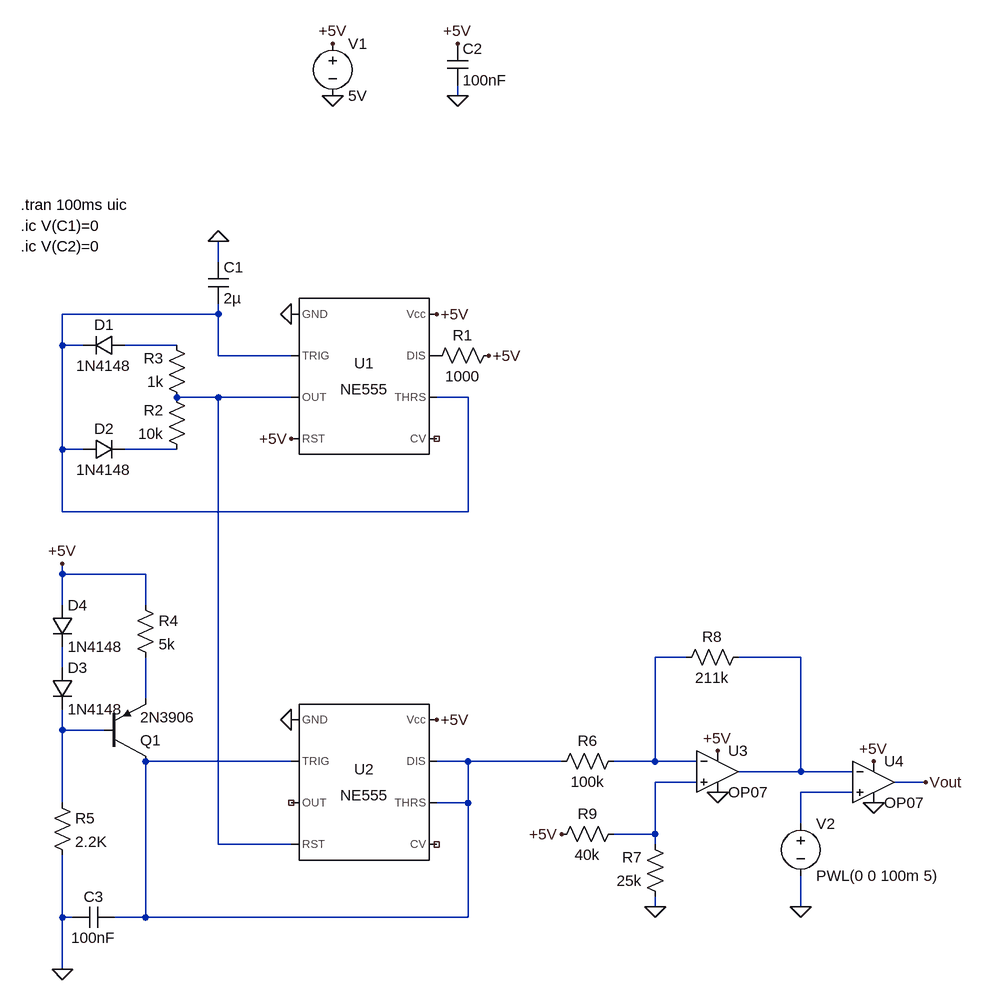
[diagram p0: schematic pwm-generator.asc]
pwm-generator.asc, the LTspice schematic file:
Version 4
SHEET 1 1160 1108
WIRE 368 -256 368 -272
WIRE 0 0 0 -32
WIRE 0 80 0 64
WIRE 0 80 -240 80
WIRE -240 128 -240 80
WIRE -208 128 -240 128
WIRE -64 128 -144 128
WIRE 0 144 0 80
WIRE 112 144 0 144
WIRE 0 208 -64 208
WIRE 112 208 0 208
WIRE 384 208 336 208
WIRE -240 288 -240 128
WIRE -208 288 -240 288
WIRE -64 288 -144 288
WIRE -240 384 -240 288
WIRE 384 384 384 208
WIRE 384 384 -240 384
WIRE -240 480 -240 464
WIRE -112 480 -240 480
WIRE -240 528 -240 480
WIRE -112 528 -112 480
WIRE 720 608 672 608
WIRE 896 608 800 608
WIRE -240 624 -240 592
WIRE -112 672 -112 608
WIRE -240 720 -240 688
WIRE -176 720 -240 720
WIRE 112 768 -112 768
WIRE 384 768 336 768
WIRE 528 768 384 768
WIRE 672 768 672 608
WIRE 672 768 608 768
WIRE 736 768 672 768
WIRE 896 784 896 608
WIRE 896 784 800 784
WIRE 976 784 896 784
WIRE 736 800 672 800
WIRE 1088 800 1040 800
WIRE 976 816 896 816
WIRE -240 832 -240 720
WIRE 384 832 384 768
WIRE 384 832 336 832
WIRE 896 864 896 816
WIRE 672 880 672 800
WIRE 672 880 608 880
WIRE 0 896 0 208
WIRE 112 896 0 896
WIRE 672 896 672 880
WIRE 672 992 672 976
WIRE 896 992 896 944
WIRE -240 1008 -240 912
WIRE -224 1008 -240 1008
WIRE -112 1008 -112 768
WIRE -112 1008 -160 1008
WIRE 384 1008 384 832
WIRE 384 1008 -112 1008
WIRE -240 1088 -240 1008
FLAG 176 -256 0
FLAG 176 -336 +5V
FLAG 336 80 +5V
FLAG 112 80 0
FLAG 112 272 +5V
FLAG 416 144 +5V
FLAG 0 -32 0
FLAG 336 704 +5V
FLAG 368 -256 0
FLAG 368 -336 +5V
FLAG -240 1088 0
FLAG -240 464 +5V
FLAG 112 704 0
FLAG 672 992 0
FLAG 768 752 +5V
FLAG 1008 768 +5V
FLAG 768 816 0
FLAG 1008 832 0
FLAG 1088 800 Vout
FLAG 896 992 0
FLAG 528 880 +5V
SYMBOL Misc\\NE555 224 176 R0
SYMATTR InstName U1
SYMBOL voltage 176 -352 R0
WINDOW 123 0 0 Left 0
WINDOW 39 0 0 Left 0
SYMATTR InstName V1
SYMATTR Value 5V
SYMBOL res 432 128 R90
WINDOW 0 0 56 VBottom 2
WINDOW 3 32 56 VTop 2
SYMATTR InstName R1
SYMATTR Value 1000
SYMBOL res -48 304 R180
WINDOW 0 36 76 Left 2
WINDOW 3 36 40 Left 2
SYMATTR InstName R2
SYMATTR Value 10k
SYMBOL res -48 224 R180
WINDOW 0 36 76 Left 2
WINDOW 3 36 40 Left 2
SYMATTR InstName R3
SYMATTR Value 1k
SYMBOL diode -144 112 R90
WINDOW 0 0 32 VBottom 2
WINDOW 3 32 32 VTop 2
SYMATTR InstName D1
SYMATTR Value 1N4148
SYMBOL diode -208 304 R270
WINDOW 0 32 32 VTop 2
WINDOW 3 0 32 VBottom 2
SYMATTR InstName D2
SYMATTR Value 1N4148
SYMBOL cap -16 0 R0
SYMATTR InstName C1
SYMATTR Value 2µ
SYMBOL Misc\\NE555 224 800 R0
SYMATTR InstName U2
SYMBOL cap 352 -336 R0
SYMATTR InstName C2
SYMATTR Value 100nF
SYMBOL diode -256 624 R0
SYMATTR InstName D3
SYMATTR Value 1N4148
SYMBOL diode -256 528 R0
SYMATTR InstName D4
SYMATTR Value 1N4148
SYMBOL res -128 512 R0
SYMATTR InstName R4
SYMATTR Value 5k
SYMBOL pnp -176 768 M180
SYMATTR InstName Q1
SYMATTR Value 2N3906
SYMBOL cap -160 992 R90
WINDOW 0 0 32 VBottom 2
WINDOW 3 32 32 VTop 2
SYMATTR InstName C3
SYMATTR Value 100nF
SYMBOL res -256 816 R0
SYMATTR InstName R5
SYMATTR Value 2.2K
SYMBOL res 624 752 R90
WINDOW 0 0 56 VBottom 2
WINDOW 3 32 56 VTop 2
SYMATTR InstName R6
SYMATTR Value 100k
SYMBOL res 688 992 R180
WINDOW 0 36 76 Left 2
WINDOW 3 36 40 Left 2
SYMATTR InstName R7
SYMATTR Value 25k
SYMBOL res 816 592 R90
WINDOW 0 0 56 VBottom 2
WINDOW 3 32 56 VTop 2
SYMATTR InstName R8
SYMATTR Value 211k
SYMBOL voltage 896 848 R0
WINDOW 123 0 0 Left 0
WINDOW 39 0 0 Left 0
SYMATTR InstName V2
SYMATTR Value PWL(0 0 100m 5)
SYMBOL OpAmps\\OP07 768 720 R0
SYMATTR InstName U3
SYMBOL OpAmps\\OP07 1008 736 R0
SYMATTR InstName U4
SYMBOL res 624 864 R90
WINDOW 0 0 56 VBottom 2
WINDOW 3 32 56 VTop 2
SYMATTR InstName R9
SYMATTR Value 40k
TEXT -304 -88 Left 2 !.tran 100ms uic
TEXT -304 -56 Left 2 !.ic V(C1)=0
TEXT -304 -24 Left 2 !.ic V(C2)=0

The netlist it stands for:
* pwm-generator.asc
XU1 0 N001 N003 +5V NC_01 N001 P001 +5V NE555  ; pins GND TRIG OUT RST CV THRS DIS Vcc
V1 +5V 0 5V
R1 +5V P001 1000
R2 N004 N003 10k
R3 N003 N002 1k
D1 N002 N001 1N4148
D2 N001 N004 1N4148
C1 0 N001 2µ
XU2 0 N010 NC_02 N003 NC_03 N010 N010 +5V NE555  ; pins GND TRIG OUT RST CV THRS DIS Vcc
C2 +5V 0 100nF
D3 N007 N009 1N4148
D4 +5V N007 1N4148
R4 +5V N008 5k
Q1 N010 N009 N008 0 2N3906
C3 N010 0 100nF
R5 N009 0 2.2K
R6 N005 N010 100k
R7 0 N011 25k
R8 N006 N005 211k
V2 N012 0 PWL(0 0 100m 5)
XU3 N011 N005 +5V 0 N006 LT1001  ; OP07, pins In+ In- V+ V- OUT
XU4 N012 N006 +5V 0 Vout LT1001  ; OP07, pins In+ In- V+ V- OUT
R9 N011 +5V 40k
.model D D
.lib standard.dio
.model NPN NPN
.model PNP PNP
.lib standard.bjt
.tran 100ms uic
.ic V(C1)=0
.ic V(C2)=0
.lib NE555.sub
.lib LTC.lib
.backanno
.end